# Altium project Coral_Dev_Baseboard.PrjPcb (part 4 of 5)

## Sheet 07_DEBUG.SchDoc
size A2; ApprovedBy: DNP; CheckedBy: DNP; Author: DNP; CompanyName: Google LLC; DrawnBy: DNP; Engineer: Bangfei/Michael/Leo; Organization: Google LLC; Address1: 1600 Amphitheatre Parkway; Address2: Mountain View, CA 94043; Address3: DNP; Address4: DNP; DocumentNumber: DNP; Revision: PVT; SheetNumber: 7; SheetTotal: 11; VersionControl_RevNumber: DNP; IsUserConfigurable: DNP; Time: DNP; ImagePath: DNP; Rule: DNP; ProjectName: Enterprise; Application_BuildNumber: DNP
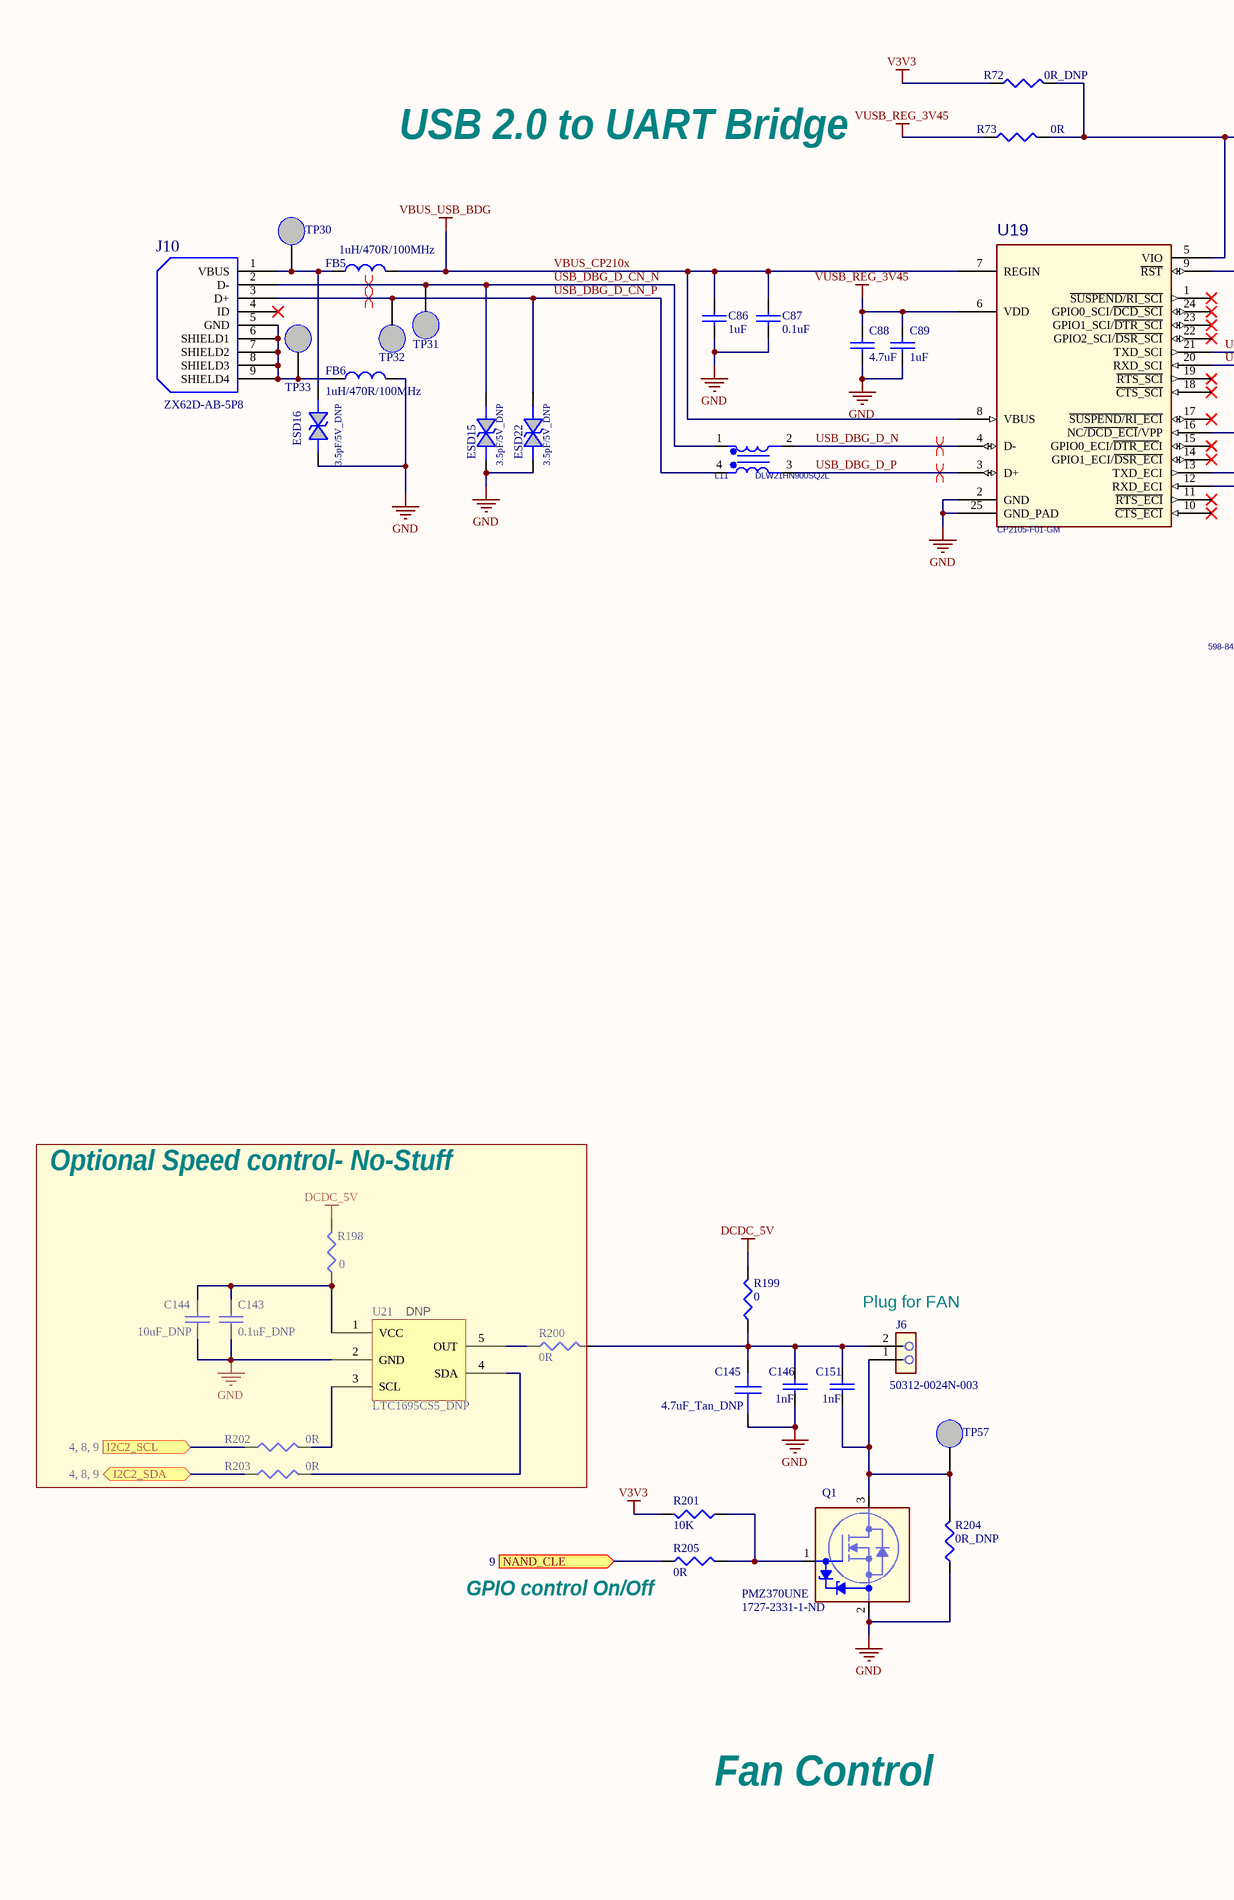
[diagram p10: 07_DEBUG.SchDoc, left]
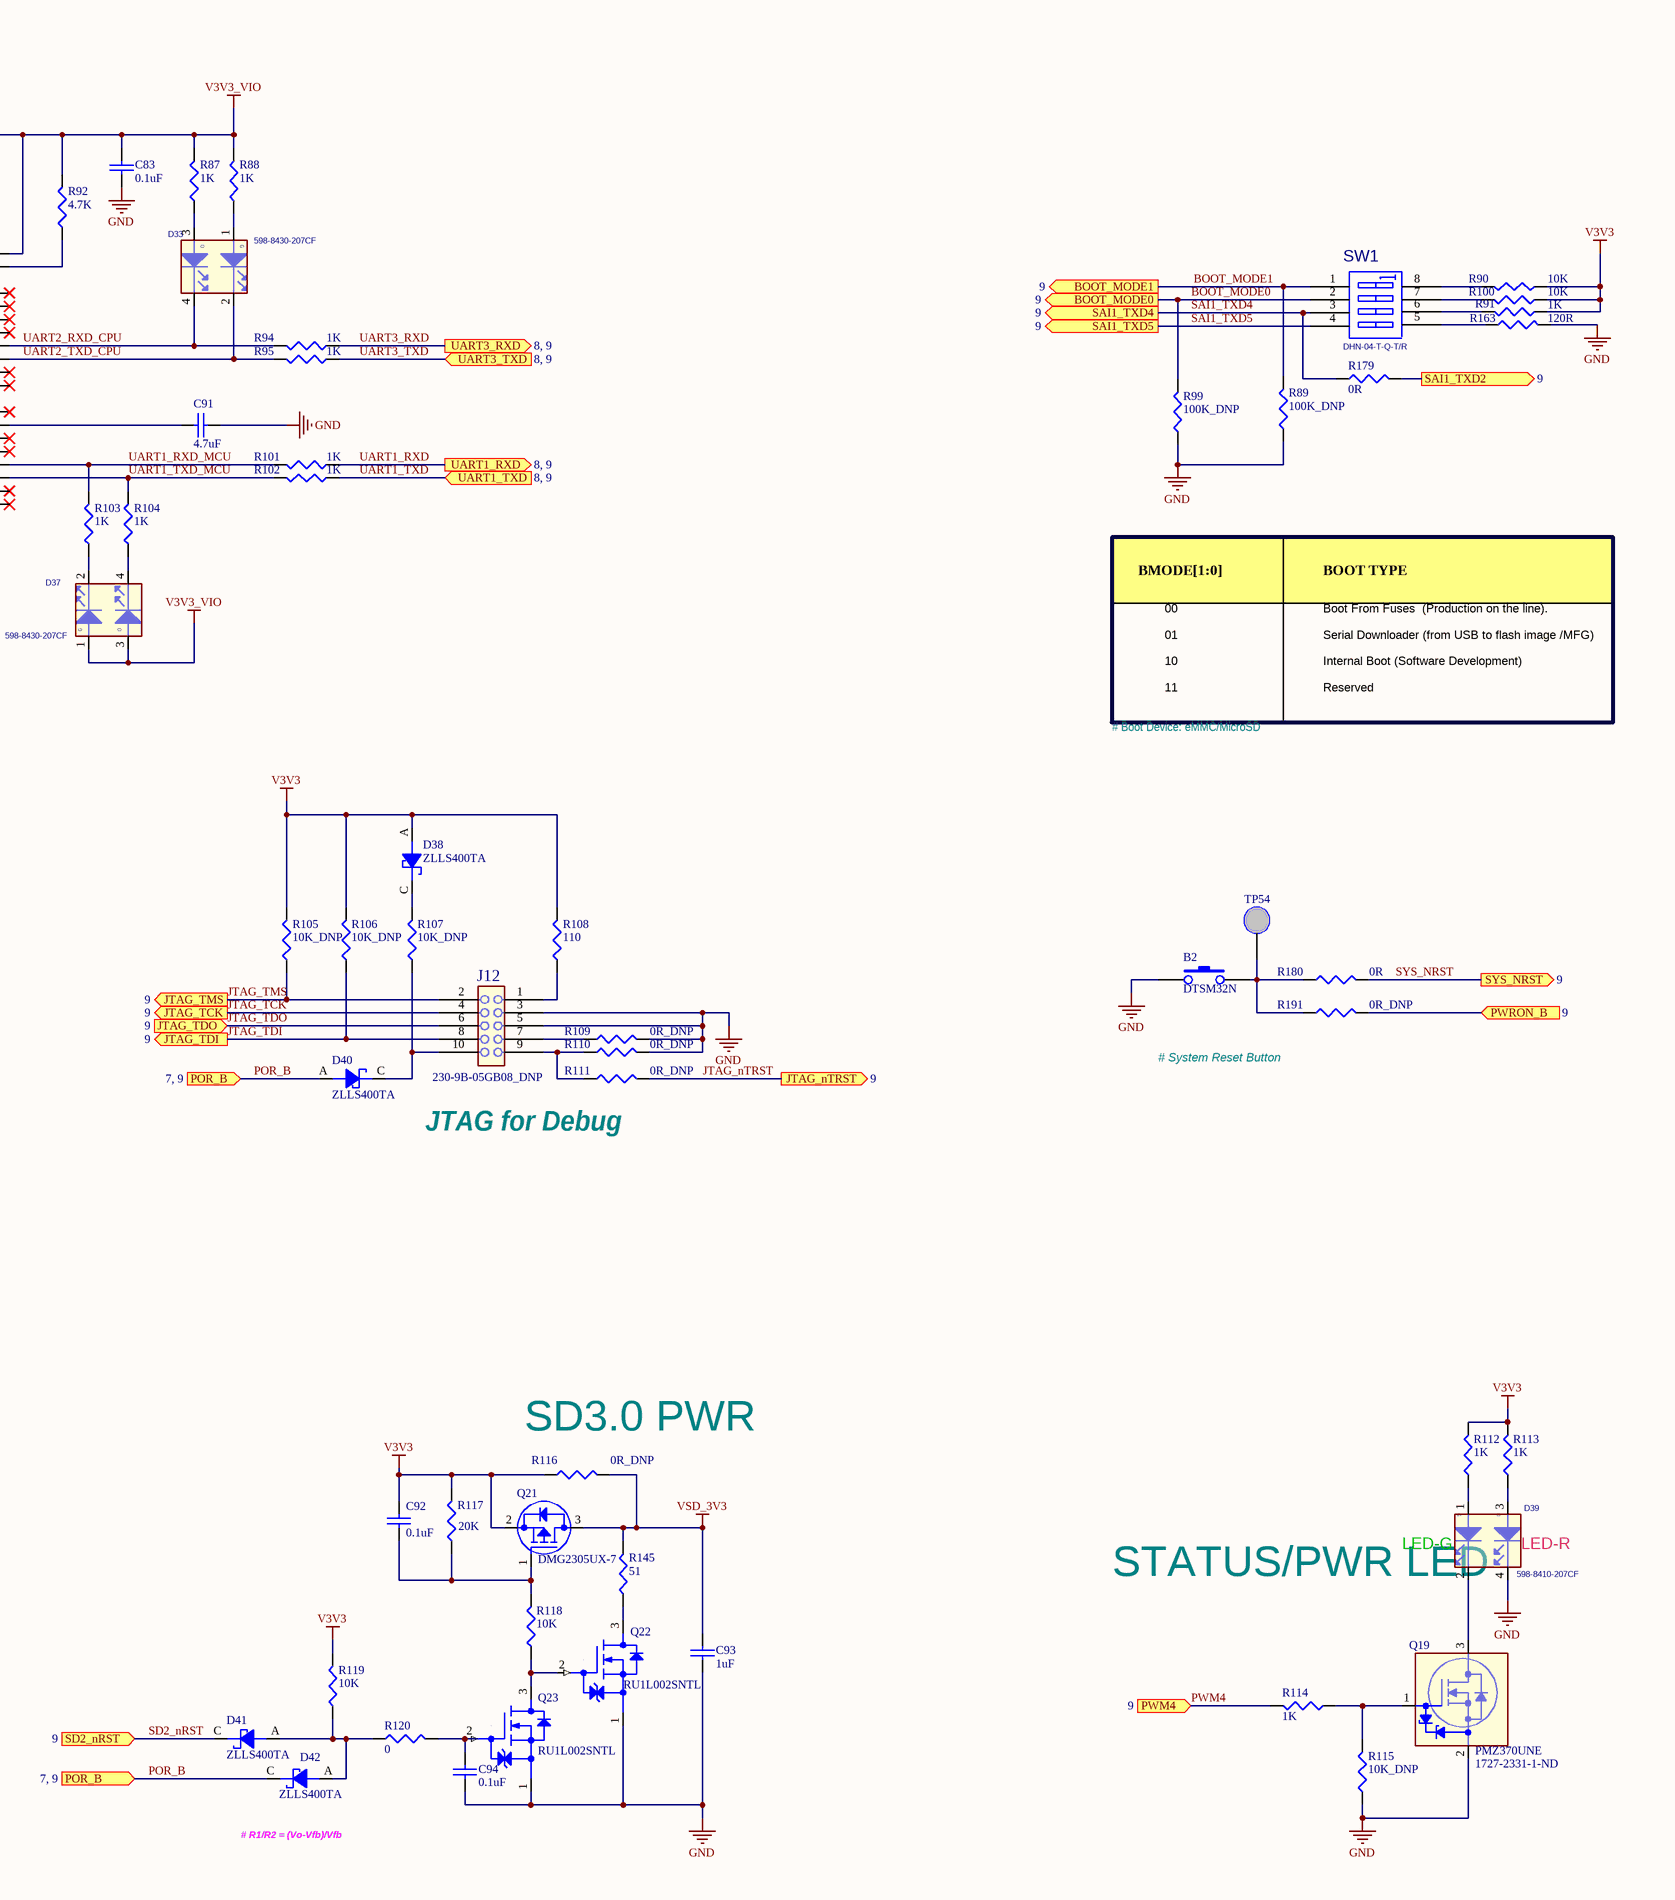
[diagram p11: 07_DEBUG.SchDoc, right]

### Parts
B2  DTSM32N  [sw2-6_0x3_5-h5_2]
C83  value 0.1uF  [0201]  (hidden comment: 0.1uF/10V)
C86  value 1uF  [0201]  (hidden comment: 1uF/6.3V)
C87  value 0.1uF  [0201]  (hidden comment: 0.1uF/10V)
C88  value 4.7uF  [0402]  (hidden comment: 4.7uF/10V)
C89  value 1uF  [0201]  (hidden comment: 1uF/6.3V)
C91  value 4.7uF  [0402]  (hidden comment: 4.7uF/10V)
C92  value 0.1uF  [0201]  (hidden comment: 0.1uF/10V)
C93  value 1uF  [0201]  (hidden comment: 1uF/6.3V)
C94  value 0.1uF  [0201]  (hidden comment: 0.1uF/10V)
C143  value 0.1uF_DNP  [0201]  (hidden comment: 0.1uF/10V)
C144  value 10uF_DNP  [0402]  (hidden comment: 10uF/10V)
C145  value 4.7uF_Tan_DNP  [1206]  (hidden comment: 47uF/25V)
C146  value 1nF  [0201]  (hidden comment: 1nF/25V)
C151  value 1nF  [0201]  (hidden comment: 1nF/25V)
D33  598-8430-207CF  [LED_0606]
D37  598-8430-207CF  [LED_0606]
D38  ZLLS400TA  [SOD323]
D39  598-8410-207CF  [LED_0606]
D40  ZLLS400TA  [SOD323]
D41  ZLLS400TA  [SOD323]
D42  ZLLS400TA  [SOD323]
ESD15  3.5pF/5V_DNP  [0201]
ESD16  3.5pF/5V_DNP  [0201]
ESD22  3.5pF/5V_DNP  [0201]
FB5  1uH/470R/100MHz  [0603]
FB6  1uH/470R/100MHz  [0603]
J6  50312-0024N-003  [SIP2-2MM-6X4_8MM-50312]
J10  ZX62D-AB-5P8  [USB5-0_65-ZX62D-AB-5P8]
J12  230-9B-05GB08_DNP  [HD2X5-1_27MM-3_35MM]
L11  DLW21HN900SQ2L  [IND4_CHOKE_0805]
Q1  PMZ370UNE  Supplier Part Number 1: 1727-2331-1-ND  [DFN10106B]
Q19  PMZ370UNE  Supplier Part Number 1: 1727-2331-1-ND  [DFN10106B]
Q21  DMG2305UX-7  [SOT-23]
Q22  RU1L002SNTL  [SOT323_3]
Q23  RU1L002SNTL  [SOT323_3]
R72  0R_DNP  [0201]
R73  0R  [0201]
R87  value 1K  [0201]  (hidden comment: 1K/1%)
R88  value 1K  [0201]  (hidden comment: 1K/1%)
R89  100K_DNP  [0201]
R90  10K  [0201]
R91  value 1K  [0201]  (hidden comment: 1K/1%)
R92  4.7K  [0201]
R94  value 1K  [0201]  (hidden comment: 1K/1%)
R95  value 1K  [0201]  (hidden comment: 1K/1%)
R99  100K_DNP  [0201]
R100  10K  [0201]
R101  value 1K  [0201]  (hidden comment: 1K/1%)
R102  value 1K  [0201]  (hidden comment: 1K/1%)
R103  value 1K  [0201]  (hidden comment: 1K/1%)
R104  value 1K  [0201]  (hidden comment: 1K/1%)
R105  10K_DNP  [0201]
R106  10K_DNP  [0201]
R107  10K_DNP  [0201]
R108  110  [0201]
R109  0R_DNP  [0201]
R110  0R_DNP  [0201]
R111  0R_DNP  [0201]
R112  value 1K  [0201]  (hidden comment: 1K/1%)
R113  value 1K  [0201]  (hidden comment: 1K/1%)
R114  value 1K  [0201]  (hidden comment: 1K/1%)
R115  10K_DNP  [0201]
R116  0R_DNP  [0402]
R117  20K  [0201]
R118  10K  [0201]
R119  10K  [0201]
R120  value 0  [0402]  (hidden comment: 0R)
R145  51  [0402]
R163  120R  [0402]
R179  0R  [0201]
R180  value 0R  [0201]  (hidden comment: 0R_DNP)
R191  0R_DNP  [0201]
R198  value 0  [0402]  (hidden comment: 0R)
R199  value 0  [0402]  (hidden comment: 0R)
R200  0R  [0402]
R201  10K  [0201]
R202  value 0R  [0201]  (hidden comment: 0)
R203  value 0R  [0201]  (hidden comment: 0)
R204  value 0R_DNP  [0402]  (hidden comment: 0R)
R205  value 0R  [0201]  (hidden comment: 0R_DNP)
SW1  DHN-04-T-Q-T/R  [SW_DIP4_SM]
TP30  TP NM  [TP_SMD_L]  (value not drawn)  (no BOM)
TP31  TP NM  [TP_SMD]  (value not drawn)  (no BOM)
TP32  TP NM  [TP_SMD]  (value not drawn)  (no BOM)
TP33  TP NM  [TP_SMD_L]  (value not drawn)  (no BOM)
TP54  TP NM  [TP_SMD_L]  (value not drawn)  (no BOM)
TP57  TP NM  [TP_SMD_L]  (value not drawn)  (no BOM)
U19  CP2105-F01-GM  [QFN24_0P5_4X4_EP]
U21  LTC1695CS5_DNP  [SOT23-S5-1695f]

### Blocks framed on the sheet
Optional Speed control- No-Stuff: C143 C144 R198 R200 R202 R203 U21

### Ports
BOOT_MODE0 (out, see 9), BOOT_MODE1 (out, see 9), I2C2_SCL (in, see 4, 8, 9), I2C2_SDA (bidir, see 4, 8, 9), JTAG_nTRST (out, see 9), JTAG_TCK (out, see 9), JTAG_TDI (out, see 9), JTAG_TDO (in, see 9), JTAG_TMS (out, see 9), NAND_CLE (in, see 9), POR_B (in, see 7, 9), PWM4 (in, see 9), PWRON_B (in, see 9), SAI1_TXD2 (out, see 9), SAI1_TXD4 (out, see 9), SAI1_TXD5 (out, see 9), SD2_nRST (in, see 9), SYS_NRST (out, see 9), UART1_RXD (out, see 8, 9), UART1_TXD (in, see 8, 9), UART3_RXD (out, see 8, 9), UART3_TXD (in, see 8, 9)

### Nets
DCDC_5V: R198.2 R199.2
GND: B2.1 C83.2 C86.2 C87.2 C88.2 C89.2 C91.2 C93.2 C94.2 C143.2 C144.2 C145.2 C146.1 D39.4(CATHODE2) ESD15.1 ESD16.1 ESD22.1 FB6.2 J12.3 J12.5 Q1.2(SOURCE) Q19.2(SOURCE) Q22.1(SOURCE) Q23.1(SOURCE) R89.1 R99.1 R109.2 R110.2 R115.1 R163.2 R204.1 U19.2(GND) U19.25(GND_PAD) U21.2(GND)
V3V3: C92.1 D38.A Q21.2(SOURCE) R72.1 R90.1 R91.1 R100.1 R105.2 R106.2 R108.2 R112.2 R113.2 R116.1 R117.2 R119.2 R201.2  [project net BB_3V3]
V3V3_VIO: C83.1 D37.1(ANODE1) D37.3(ANODE2) R72.2 R73.2 R87.2 R88.2 R92.2 U19.5(VIO)
VBUS_CP210x: C86.1 C87.1 FB5.2 U19.7(REGIN) U19.8(VBUS)  [also labelled VBUS_USB_BDG]
VSD_3V3: C93.1 Q21.3(DRAIN) R116.2 R145.2
VUSB_REG_3V45: C88.1 C89.1 R73.1 U19.6(VDD)
BOOT_MODE0: R99.2 SW1.2(A2) ; port BOOT_MODE0
BOOT_MODE1: R89.2 SW1.1(A1) ; port BOOT_MODE1
I2C2_SCL: R202.1 ; port I2C2_SCL
I2C2_SDA: R203.1 ; port I2C2_SDA
JTAG_nTRST: R111.2 ; port JTAG_nTRST
JTAG_TCK: J12.4 ; port JTAG_TCK
JTAG_TDI: J12.8 R106.1 ; port JTAG_TDI
JTAG_TDO: J12.6 ; port JTAG_TDO
JTAG_TMS: J12.2 R105.1 ; port JTAG_TMS
POR_B: D40.A D42.C ; port POR_B
PWM4: R114.2 ; port PWM4
SAI1_TXD4: R179.1 SW1.3(A3) ; port SAI1_TXD4
SAI1_TXD5: SW1.4(A4) ; port SAI1_TXD5
SD2_nRST: D41.C ; port SD2_nRST
SYS_NRST: R180.2 ; port SYS_NRST
UART1_RXD: R101.1 ; port UART1_RXD
UART1_RXD_MCU: R101.2 R103.2 U19.13(TXD_ECI)
UART1_TXD: R102.1 ; port UART1_TXD
UART1_TXD_MCU: R102.2 R104.2 U19.12(RXD_ECI)
UART2_RXD_CPU: D33.4(CATHODE2) R94.2 U19.21(TXD_SCI)
UART2_TXD_CPU: D33.2(CATHODE1) R95.2 U19.20(RXD_SCI)
UART3_RXD: R94.1 ; port UART3_RXD
UART3_TXD: R95.1 ; port UART3_TXD
USB_DBG_D_CN_N: ESD15.2 J10.2(D-) L11.1 TP31.1
USB_DBG_D_CN_P: ESD22.2 J10.3(D+) L11.4 TP32.1
USB_DBG_D_N: L11.2 U19.4(D-)
USB_DBG_D_P: L11.3 U19.3(D+)
NetB2_2: B2.2 R180.1 R191.1 TP54.1
NetC91_1: C91.1 U19.16(NC~{/DCD_ECI}/VPP)
NetC92_2: C92.2 Q21.1(GATE) R117.1 R118.2
NetC94_1: C94.1 Q23.2(GATE) R120.2
NetC143_1: C143.1 C144.1 R198.1 U21.1(VCC)
NetC145_1: C145.1 C146.2 C151.2 J6.2 R199.1 R200.2
NetC151_1: C151.1 J6.1 Q1.3(DRAIN) R204.2 TP57.1
NetD33_1: D33.1(ANODE1) R88.1
NetD33_3: D33.3(ANODE2) R87.1
NetD37_2: D37.2(CATHODE1) R103.1
NetD37_4: D37.4(CATHODE2) R104.1
NetD38_C: D38.C R107.2
NetD39_1: D39.1(ANODE1) R112.1
NetD39_2: D39.2(CATHODE1) Q19.3(DRAIN)
NetD39_3: D39.3(ANODE2) R113.1
NetD40_C: D40.C J12.10 R107.1
NetD41_A: D41.A D42.A R119.1 R120.1
NetESD16_2: ESD16.2 FB5.1 J10.1(VBUS) TP30.1
NetFB6_1: FB6.1 J10.5(GND) J10.6(SHIELD1) J10.7(SHIELD2) J10.8(SHIELD3) J10.9(SHIELD4) TP33.1
NetJ12_1: J12.1 R108.1
NetJ12_7: J12.7 R109.1
NetJ12_9: J12.9 R110.1 R111.1
NetJ1310_10: R205.1 ; port NAND_CLE
NetJ1312_30: R179.2 ; port SAI1_TXD2
NetJ1312_86: R191.2 ; port PWRON_B
NetQ1_1: Q1.1(GATE) R201.1 R205.2
NetQ19_1: Q19.1(GATE) R114.1 R115.2
NetQ22_2: Q22.2(GATE) Q23.3(DRAIN) R118.1
NetQ22_3: Q22.3(DRAIN) R145.1
NetR90_2: R90.2 SW1.8(B1)
NetR91_2: R91.2 SW1.6(B3)
NetR92_1: R92.1 U19.9(~{RST})
NetR100_2: R100.2 SW1.7(B2)
NetR163_1: R163.1 SW1.5(B4)
NetR200_1: R200.1 U21.5(OUT)
NetR202_2: R202.2 U21.3(SCL)
NetR203_2: R203.2 U21.4(SDA)

Not connected (* = marked no-connect by the designer): J10 4(ID)*; U19 1(~{SUSPEND/RI_SCI})* 10(~{CTS_ECI})* 11(~{RTS_ECI})* 14(GPIO1_ECI/~{DSR_ECI})* 15(GPIO0_ECI/~{DTR_EC}I)* 17(~{SUSPEND/RI_ECI})* 18(~{CTS_SCI})* 19(~{RTS_SCI})* 22(GPIO2_SCI/~{DSR_SCI})* 23(GPIO1_SCI/~{DTR_SCI})* 24(GPIO0_SCI/~{DCD_SCI})*

### Layout directives
differential pair: USB_DBG_D_CN_N, USB_DBG_D_CN_P, USB_DBG_D_N, USB_DBG_D_P

### Notes on the sheet
- USB 2.0 to UART Bridge
- BMODE[1:0]
- 00
- 01
- BOOT TYPE
- Boot From Fuses  (Production on the line).
- Serial Downloader (from USB to flash image /MFG)
- 10
- 11
- Internal Boot (Software Development)
- Reserved
- # Boot Device: eMMC/MicroSD
- # System Reset Button
- (near R111) JTAG for Debug
- (near U21) DNP
- (near J6) Plug for FAN
- (near R116) SD3.0 PWR
- (near D39) LED-G
- (near D39) LED-R
- (near R205) GPIO control On/Off
- STATUS/PWR LED
- Fan Control
- # R1/R2 = (Vo-Vfb)/Vfb
- Project:
- Engineer:
- Date:
- File:
- Revision:
- Sheet
- of
- (in symbol LED4_DUAL_OG) O; G

### Library data of the parts
B2 = SW-PB: Tact Switch; MPN: DTSM-32N-Q-TR; QCI MPN: DTSM-32N-Q-T/R; Function Code: DBG; QPN: DHP00032N02; QPN Description: SWITCH TACT SMD DTSM-61N-S-Q-T/R; Supplier Part Number 1: 679-2307-2-ND; Supplier 1: Digi-Key; Value: DTSM32N; QCI Supplier: DIP
C83 C87 C92 C94 = CAP_0201_0.1uF: CAP CER 0.1UF 10V 10% X5R 0201; MPN: C0603X5R1A104K030BC; QCI MPN: GRM033R61A104K; QPN: CH4102K9E00; QPN Description: CAP CHIP 0.1U 10V(+-10%,X5R,0201); Function Code: DBG; Supplier 1: Digi-Key; Supplier Part Number 1: 445-7318-1-ND; QCI Supplier: MUR
C86 C89 C93 = CAP_0201_1.0uF: CAP CER 1UF 6.3V 20% X5R 0201; MPN: C0603X5R0J105M030BC; QCI MPN: GRM033R60J105M; QPN: CH5101M9E02; QPN Description: CAP CHIP 1UF 6.3V(+-20%,X5R,0201); Function Code: DBG; Supplier 1: Digi-Key; Supplier Part Number 1: 445-8008-1-ND; QCI Supplier: MUR
C88 C91 = CAP_0402_4.7uF: CAP CER 4.7UF 10V 20% X5R 0402; MPN: C1005X5R1A475M050BC; QCI MPN: GRM155R61A475M; QPN: CH5472M9B01; QPN Description: CAP CHIP 4.7U 10V(+-20%,X5R,0402); Function Code: DBG; Supplier 1: Digi-Key; Supplier Part Number 1: 445-8023-1-ND; QCI Supplier: MUR
C143 = CAP_0201_0.1uF: as C5 on sheet 05_AUDIO; Supplier 1: Digi-Key; Supplier Part Number 1: 445-7318-1-ND; QCI Supplier: MUR
C144 = CAP_0402_10uF: as C141 on sheet 05_AUDIO; Supplier 1: Digi-Key; Supplier Part Number 1: 1276-1450-1-ND; QCI Supplier: MUR
C145 = CAP_1206_47uF_25V: CAP CER 47UF 25V 20% 1206; MPN: C3216JB1E476M160AC; Function Code: USB; Supplier 1: Digi-Key; Supplier Part Number 1: 445-11717-1-ND
C146 C151 = CAP_0201_1.0nF: as C20 on sheet 05_AUDIO; Supplier 1: Digi-Key; Supplier Part Number 1: 490-3184-2-ND; QCI Supplier: MUR
D33 D37 = LED4_DUAL_OG: LED BI-COLOR ORANGE/GRN 20MA SMD 0606; Function Code: DBG; QPN: BEAG0003ZA0; QPN Description: LED SMD 4P O/G(598-8430-207CF); Supplier 1: Mouser; Supplier Part Number 1: 645-598-8430-207F; MPN: 598-8430-207CF; QCI MPN: 598-8430-207CF; QCI Supplier: DLH
D38 D40-D42 = DIODE_SCHTKY: DIODE SCHOTTKY 40V 520MA SOD323; Function Code: DBG; QPN: BCS400TA000; QPN Description: DIODE SCHOTTKY ZLLS400TA(20V,1A); Supplier 1: Digi-Key; Supplier Part Number 1: ZLLS400TACT-ND; QCI Supplier: DDS; MPN: ZLLS400TA; QCI MPN: ZLLS400TA
D39 = LED4_DUAL_OG: LED BI-COLOR ORANGE/GRN 20MA SMD 0606; MPN: 598-8430-207CF; Function Code: DBG; QPN: BEAG0003ZA0; QPN Description: LED SMD 4P O/G(598-8430-207CF); Supplier 1: Mouser; Supplier Part Number 1: 645-598-8430-207F; QCI MPN: 598-8430-207CF; QCI Supplier: DLH
ESD15 ESD16 ESD22 = DIODE BI-DIR TRIG: DIODE TVS 15kV 10V 50A 8pF SMT RoHS; MPN: DESD5V0V1BCSP-7; QPN: BC5V0V1BZ02; QPN Description: DIODE ESD SMD DESD5V0V1BCSP-7 6V,DSN0603; Function Code: DBG; DNP: V; QCI MPN: DESD5V0V1BCSP-7; QCI Supplier: DDS
FB5 FB6 = INDUCTOR_BLM18PG471SN1: FERRITE CHIP 470 OHM 1.0A 0603; QCI MPN: BLM18PG471SN1D; QPN: CX8PG471000; QPN Description: EMI FILTER BLM18PG471SN1D(470,1000MA); Function Code: DBG; Supplier 1: Digi-Key; Supplier Part Number 1: 490-5223-1-ND; Value: 1uH/470R/100MHz; QCI Supplier: MUR; MPN: BLM18PG471SN1
J6 = HEADER 1X2: CONN DIP HEADER 2P 1R MS(P2.0,H6.2); Function Code: DCD; QPN: DFHD02MS182; MPN: 50312-0024N-003; QCI MPN: 50312-0024N-003; QCI Supplier: ACS; QPN Description: CONN DIP HEADER 2P 1R MS(P2.0,H6.2)
J10 = USB_AB: Micro USB AB Connector, Standard SMT + DIP; QPN: DFHS05FR095; QPN Description: CONN DIP MICRO USB 5P 1R FR(P0.65,H2.95); Function Code: DBG; Supplier 1: Digi-Key; Supplier Part Number 1: H11494CT-ND; Value: ZX62D-AB-5P8; QCI Supplier: HRS; MPN: ZX62D-AB-5P8; QCI MPN: ZX62D-AB-5P8
J12 = HEADER 2x5: 2x5 pin header, 1.27mm pitch, THM; DNP: V; Function Code: DBG; MPN: 230-9B-05GB08; Supplier 1: Digi-Key; Supplier Part Number 1: 609-3712-ND; Value: 230-9B-05GB08_DNP; QCI Supplier: Pinrex
L11 = IND_CMC_DLW21: IND CHK 90 OHM@100MHZ 330MA 25% 0805; QPN: CX1HN900000; QPN Description: EMI FILTER DLW21HN900SQ2L(90,330MA); Function Code: DBG; Supplier 1: Digi-Key; Supplier Part Number 1: 490-1064-1-ND; MPN: DLW21HN900SQ2L; QCI MPN: DLW21HN900SQ2L; QCI Supplier: MUR
Q1 = NMOS_NX3008NBK: N-Channel 30V 590mA, SMT DFN1006B-3; MPN: PMZB550UNEYL; Function Code: USB; QPN: BAM03700000; QPN Description: TRANS MOSFET PMZ370UNE (30V,0.9 A,0.36W); Supplier 1: Digi-Key; QCI MPN: PMZ370UNE; QCI Supplier: NXP
Q19 = NMOS_NX3008NBK: N-Channel 30V 590mA, SMT DFN1006B-3; MPN: PMZB550UNEYL; Function Code: DBG; QPN: BAM03700000; QPN Description: TRANS MOSFET PMZ370UNE (30V,0.9 A,0.36W); Supplier 1: Digi-Key; QCI MPN: PMZ370UNE; QCI Supplier: NXP
Q21 = MOSFET_P: P-Channel 20V 4.2A (Ta) 1.4W (Ta) Surface Mount SOT-23; Function Code: DBG; QPN: BAM23050008; QPN Description: TRANS MOS DMG2305UX-7(20V,4.2A,1.4W); Supplier 1: Digi-Key; Supplier Part Number 1: DMG2305UX-13DITR-ND; MPN: DMG2305UX-7; QCI MPN: DMG2305UX-7; QCI Supplier: DDS
Q22 Q23 = 2SK3018: N-Channel 30V 100mA (Ta) 200mW (Ta) Surface Mount SOT-323; QPN: BAM1L000000; QPN Description: TRANS MOS RU1L002SN(60V,0.25A,0.2W)SC-85; Function Code: DBG; MPN: SOT323_3; QCI MPN: RU1L002SN; QCI Supplier: ROH
R72 R109-R111 R180 R191 R202 R203 = R_0201_0: RES SMD 0.0OHM JUMPER 1/20W 0201; MPN: ERJ-1GN0R00C; QCI MPN: RC0201JR-130RL; DNP: V; QPN: CS00001JE18; QPN Description: RES CHIP 0(1/20W,+-5%,0201); Function Code: DBG; Supplier 1: Digi-Key; Supplier Part Number 1: P15979CT-ND; QCI Supplier: YGO
  R72 R109-R111 R191: VALUE: 0R_DNP
R73 = R_0201_0: RES SMD 0.0OHM JUMPER 1/20W 0201; MPN: ERJ-1GN0R00C; QCI MPN: RC0201JR-130RL; QPN: CS00001JE18; QPN Description: RES CHIP 0(1/20W,+-5%,0201); Function Code: DBG; Supplier 1: Digi-Key; Supplier Part Number 1: P15979CT-ND; VALUE: 0R; QCI Supplier: YGO
R87 R88 R94 R95 R101-R104 R112-R114 = R_0201_1K: RES SMD 1K OHM 1% 1/20W 0201; MPN: ERJ-1GEF1001C; QCI MPN: RC0201FR-131KL; QPN: CS21001FE04; QPN Description: RES CHIP 1K 1/20W +-1%(0201); Function Code: DBG; Supplier 1: Digi-Key; Supplier Part Number 1: P1.00KABCT-ND; QCI Supplier: YGO
R89 R99 = R_0201_100K: RES SMD 100K OHM JUMPER 1/20W  0201; MPN: ERJ-1GEF1003C; QCI MPN: RC0201FR-07100KL; DNP: V; QPN: TS41001FE04; QPN Description: RES CHIP 100K 1/20W +-1%(0201)EMS-SEL; Function Code: DBG; Supplier 1: Digi-Key; VALUE: 100K_DNP; Supplier Part Number 1: P100KABCT-ND; QCI Supplier: YGO
R90 R100 R118 R119 = R_0201_10K: RES SMD 10K OHM JUMPER 1/20W  0201; MPN: ERJ-1GEF103C; QCI MPN: RC0201JR-1310KL; QPN: CS31001JE16; QPN Description: RES CHIP 10K 1/20W +-5%(0201); Function Code: DBG; Supplier 1: Digi-Key; VALUE: 10K; Supplier Part Number 1: P10.0KABCT-ND; QCI Supplier: YGO
R91 = R_0201_1K: RES SMD 1K OHM 1% 1/20W 0201; MPN: ERJ-1GEF1001C; QCI MPN: RC0201FR-131KL; QPN: CS21001FE04; QPN Description: RES CHIP 1K 1/20W +-1%(0201); Function Code: USB; Supplier 1: Digi-Key; Supplier Part Number 1: P1.00KABCT-ND; QCI Supplier: YGO
R92 = R_0201_4.7K: RES SMD 4.7K OHM 1% 1/20W 0201; MPN: ERJ-1GEF4701C; QCI MPN: RC0201FR-134K7L; QPN: CS24701FE00; QPN Description: RES CHIP 4.7K 1/20W +-1%(0201; Function Code: DBG; Supplier 1: Digi-Key; Supplier Part Number 1: P4.70KABCT-ND; VALUE: 4.7K; QCI Supplier: YGO
R105-R107 R115 = R_0201_10K: RES SMD 10K OHM JUMPER 1/20W  0201; MPN: ERJ-1GEF103C; QCI MPN: RC0201JR-1310KL; DNP: V; QPN: CS31001JE16; QPN Description: RES CHIP 10K 1/20W +-5%(0201); Function Code: DBG; Supplier 1: Digi-Key; VALUE: 10K_DNP; Supplier Part Number 1: P10.0KABCT-ND; QCI Supplier: YGO
R108 = R_0201_110: RES SMD 110 OHM 1% 1/20W 0201; MPN: ERJ-1GEF1100C; QCI MPN: RC0201FR-07110RL; QPN: CS11101FE00; QPN Description: RES CHIP 110 1/20W +-1% (0201); Function Code: DBG; Supplier 1: Digi-Key; Supplier Part Number 1: P110ABCT-ND; VALUE: 110; QCI Supplier: YGO
R116 = R_0402_0: RES SMD 0.0 OHM JUMPER 1/10W  0402; MPN: ERJ-2GE0R00X; QCI MPN: RC0402FR-070RL; DNP: V; QPN: CS00002FB00; QPN Description: RES CHIP 0 1/16W +-1%(0402); Function Code: DBG; Supplier 1: Digi-Key; Supplier Part Number 1: P0.0JCT-ND; VALUE: 0R_DNP; QCI Supplier: YGO
R117 = R_0201_20K: RES SMD 20K OHM 1% 1/20W 0201; MPN: ERJ-1GEF2002C; QCI MPN: RC0201FR-0720KL; QPN: CS32001FE00; QPN Description: RES CHIP 20K 1/20W +-1%(0201); Function Code: DBG; Supplier 1: Digi-Key; Supplier Part Number 1: P20.0KABCT-ND; VALUE: 20K; QCI Supplier: YGO
R120 R198-R200 = R_0402_0: as R174 on sheet 05_AUDIO; Supplier 1: Digi-Key; Supplier Part Number 1: P0.0JCT-ND; QCI Supplier: YGO
  R200: VALUE: 0R
R145 = R_0402_51: RES SMD 51 OHM 1% 1/10W 0402; MPN: ERJ-2RKF51R0X; QCI MPN: RC0402FR-0751RL; QPN: CS05102FB09; QPN Description: RES CHIP 51 1/16W +-1% (0402); Function Code: DBG; Supplier 1: Digi-Key; Supplier Part Number 1: P51.0LCT-ND; VALUE: 51; QCI Supplier: YGO
R163 = R_0402_120: RES SMD 120 OHM 1% 1/10W 0402; MPN: RC0402FR-07120R; QPN: CS11202FB03; QPN Description: RES CHIP 120 1/16W +-1%(0402); Function Code: DBG; Supplier 1: Digi-Key; Supplier Part Number 1: P120LTR-ND; VALUE: 120R; QCI Supplier: YGO; QCI MPN: RC0402FR-07120R
R179 = R_0805_0: as R24 on sheet 05_AUDIO; Supplier 1: Digi-Key; Supplier Part Number 1: P15979CT-ND; Value: 0R; QCI Supplier: YGO
R201 = R_0201_10K: RES SMD 10K OHM JUMPER 1/20W  0201; MPN: ERJ-1GEF103C; QCI MPN: RC0201JR-1310KL; QPN: CS31001JE16; QPN Description: RES CHIP 10K 1/20W +-5%(0201); Function Code: USB; Supplier 1: Digi-Key; VALUE: 10K; Supplier Part Number 1: P10.0KABCT-ND; QCI Supplier: YGO
R204 = R_0402_0: RES SMD 0.0 OHM JUMPER 1/10W  0402; MPN: ERJ-2GE0R00X; QCI MPN: RC0402FR-070RL; QPN: CS00002FB00; QPN Description: RES CHIP 0 1/16W +-1%(0402); Function Code: USB; Supplier 1: Digi-Key; Supplier Part Number 1: P0.0JCT-ND; QCI Supplier: YGO
R205 = R_0201_0: RES SMD 0.0OHM JUMPER 1/20W 0201; MPN: ERJ-1GN0R00C; QCI MPN: RC0201JR-130RL; DNP: V; QPN: CS00001JE18; QPN Description: RES CHIP 0(1/20W,+-5%,0201); Function Code: USB; Supplier 1: Digi-Key; Supplier Part Number 1: P15979CT-ND; QCI Supplier: YGO
SW1 = SW_DIP-4: SW 4P SPST DIP 25MA 24V SMT; Function Code: DBG; QPN: DHDDHN04T00; QPN Description: SWITCH DIP(DHN-04-T-Q-T/R); MPN: DHN-04-T-Q-T/R; QCI MPN: DHN-04-T-Q-T/R; QCI Supplier: DIP
TP30 TP33 TP54 TP57 = TP_L: TEST POINT (Large)
TP31 TP32 = TP: TEST POIN
U19 = CP2105_QFN24P: IC XCVR USB TO DUAL-UART 3.0-3.6V QFN24; QPN: AL002105001; QPN Description: IC CTRL(24P)CP2105-F01-GM(QFN); Function Code: DBG; Supplier 1: Digi-Key; Supplier Part Number 1: CP2105-F01-GMRCT-ND; MPN: CP2105-F01-GM; QCI MPN: CP2105-F01-GM; QCI Supplier: SLI
U21 = LTC1695: LTC1695CS5

## Sheet 08_EXP_CN.SchDoc
size A2; ApprovedBy: DNP; CheckedBy: DNP; Author: DNP; CompanyName: Google LLC; DrawnBy: DNP; Engineer: Bangfei/Michael/Leo; Organization: Google LLC; Address1: 1600 Amphitheatre Parkway; Address2: Mountain View, CA 94043; Address3: DNP; Address4: DNP; DocumentNumber: DNP; Revision: PVT; SheetNumber: 8; SheetTotal: 11; VersionControl_RevNumber: DNP; IsUserConfigurable: DNP; Time: DNP; ImagePath: DNP; Rule: DNP; ProjectName: Enterprise; Application_BuildNumber: DNP
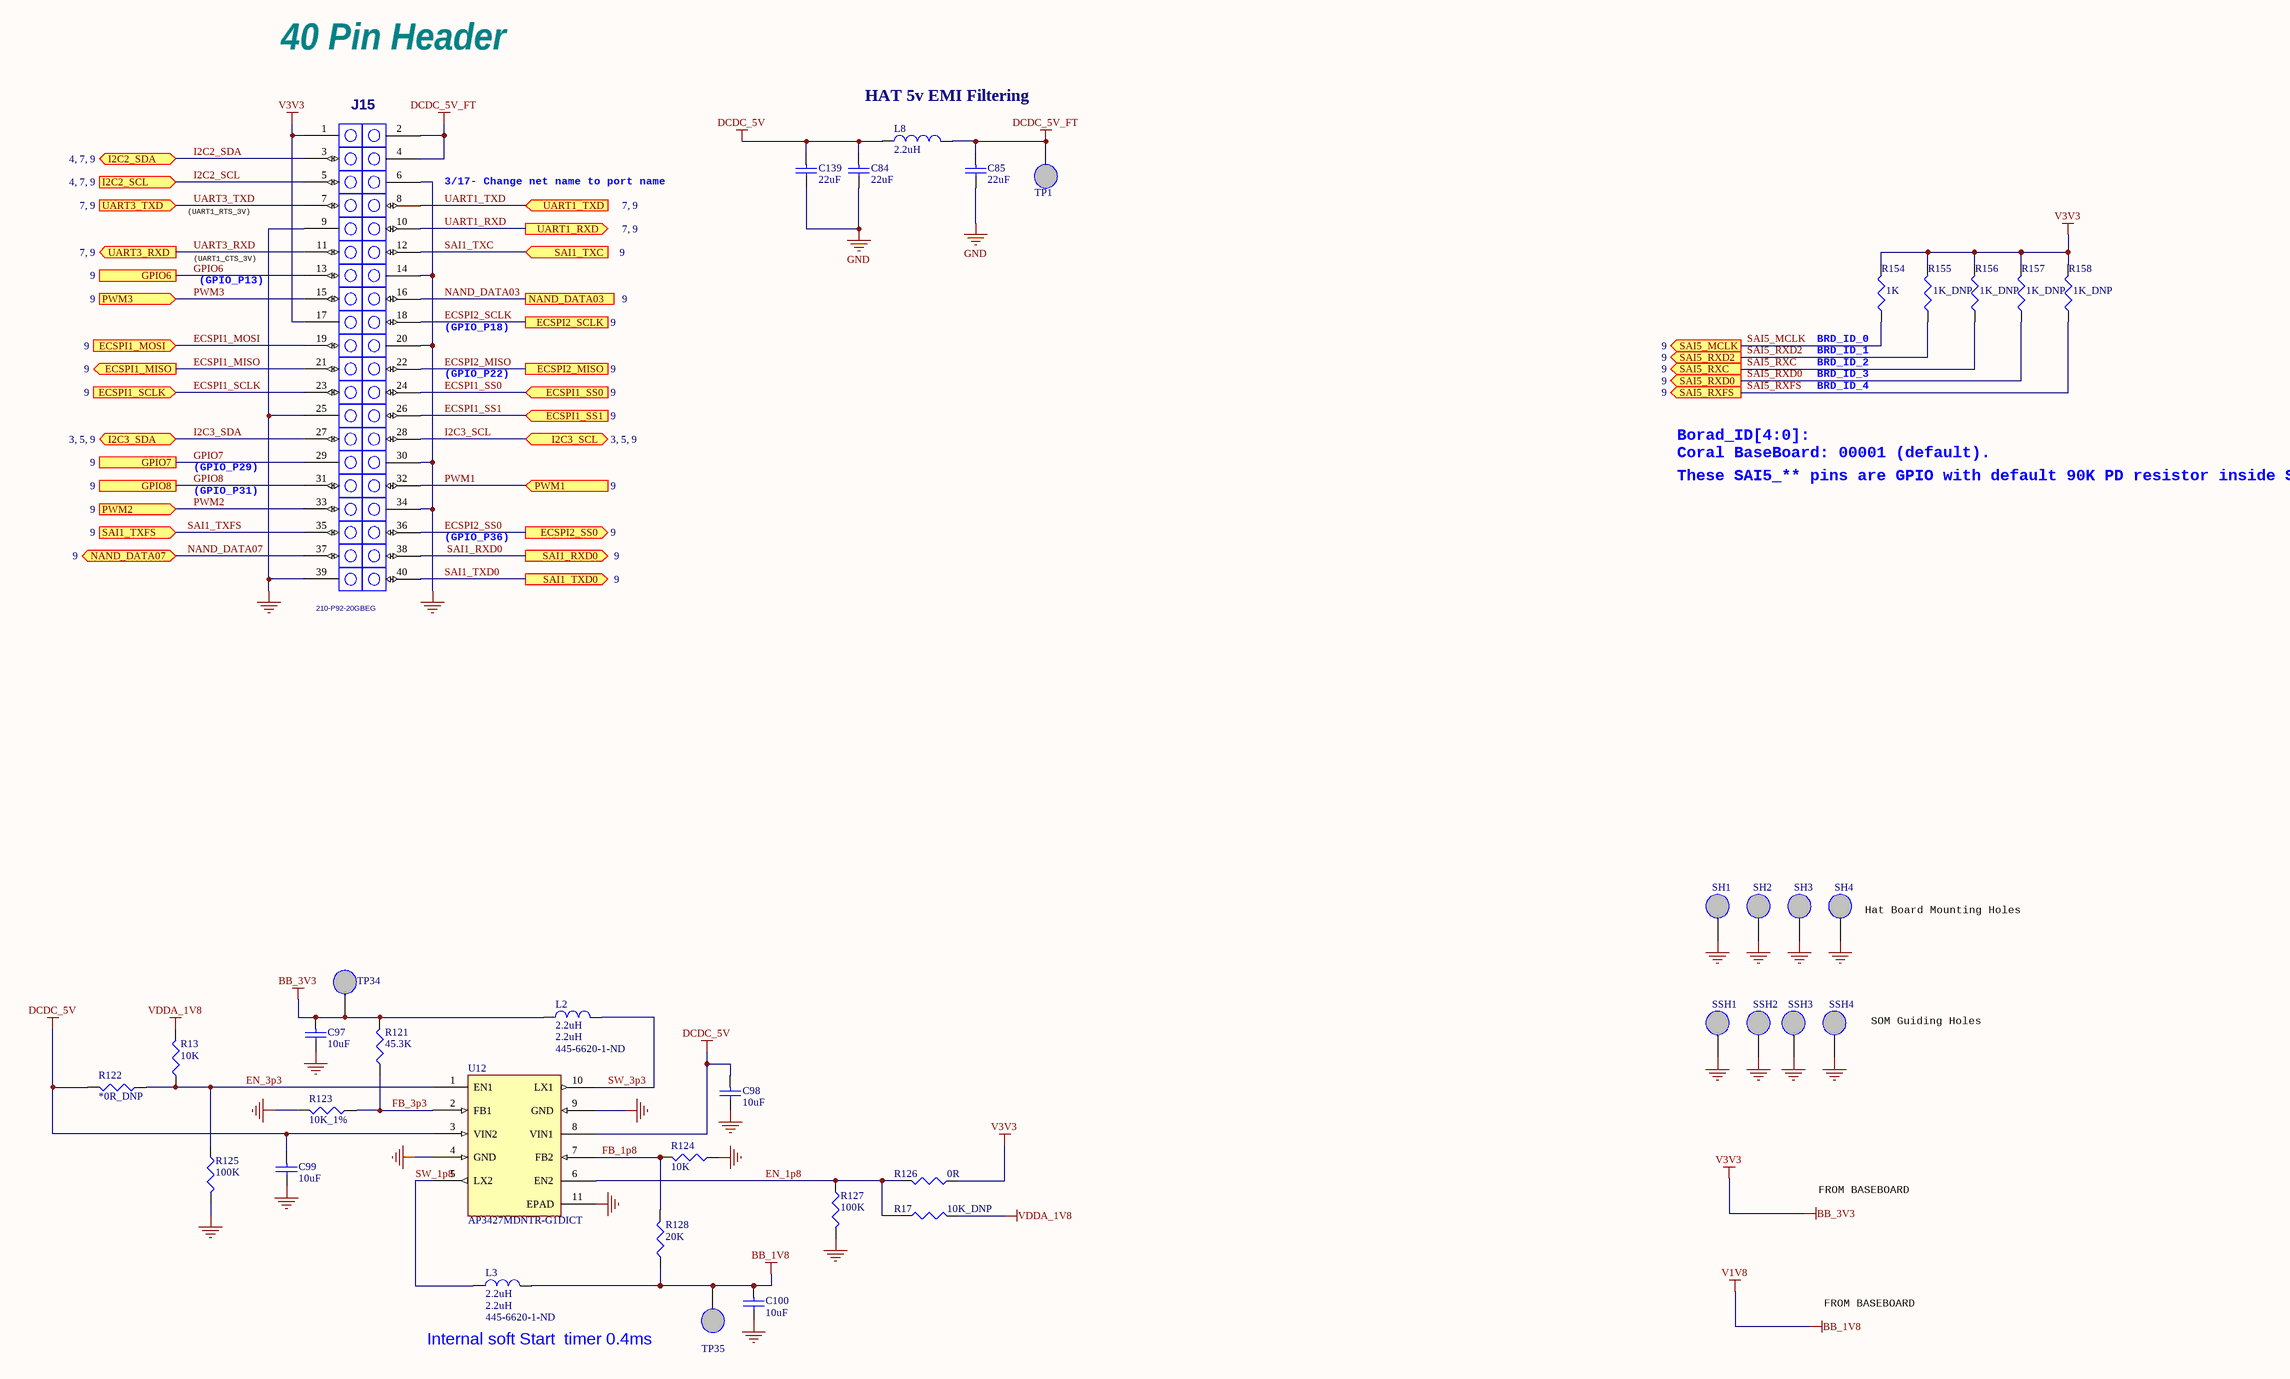
[diagram p12: 08_EXP_CN.SchDoc]

### Parts
C84  value 22uF  [0603]  (hidden comment: 22uF/10V)
C85  value 22uF  [0603]  (hidden comment: 22uF/10V)
C97  value 10uF  [0402]  (hidden comment: 10uF/10V)
C98  value 10uF  [0402]  (hidden comment: 10uF/10V)
C99  value 10uF  [0402]  (hidden comment: 10uF/10V)
C100  value 10uF  [0402]  (hidden comment: 10uF/10V)
C139  value 22uF  [0603]  (hidden comment: 22uF/10V)
J15  210-P92-20GBEG  [HTSW-120-41-G-D]
L2  2.2uH  Supplier Part Number 1: 445-6620-1-ND  [INDC2016X12L]
L3  2.2uH  Supplier Part Number 1: 445-6620-1-ND  [INDC2016X12L]
L8  2.2uH  [0805_PADS]
R13  value 10K  [0201]  (hidden comment: 10K_DNP)
R17  10K_DNP  [0201]
R121  45.3K  [0201]
R122  value *0R_DNP  [0201]  (hidden comment: 0R)
R123  value 10K_1%  [0201]  (hidden comment: 10K)
R124  10K  [0201]
R125  100K  [0201]
R126  0R  [0201]
R127  100K  [0201]
R128  20K  [0201]
R154  value 1K  [0201]  (hidden comment: 1K/1%)
R155  1K_DNP  [0201]
R156  1K_DNP  [0201]
R157  1K_DNP  [0201]
R158  1K_DNP  [0201]
SH1  TP NM  [hole236-110]  (value not drawn)  (no BOM)
SH2  TP NM  [hole236-110]  (value not drawn)  (no BOM)
SH3  TP NM  [hole236-110]  (value not drawn)  (no BOM)
SH4  TP NM  [hole236-110]  (value not drawn)  (no BOM)
SSH1  stand-off  [hole120-80]  (value not drawn)  (no BOM)
SSH2  stand-off  [hole120-80]  (value not drawn)  (no BOM)
SSH3  stand-off  [hole120-80]  (value not drawn)  (no BOM)
SSH4  stand-off  [hole120-80]  (value not drawn)  (no BOM)
TP1  TP NM  [TP_SMD]  (value not drawn)  (no BOM)
TP34  TP NM  [TP_SMD_L]  (value not drawn)  (no BOM)
TP35  TP NM  [TP_SMD_L]  (value not drawn)  (no BOM)
U12  AP3427MDNTR-G1DICT  [DFN_10_3X3]

### Ports
ECSPI1_MISO (out, see 9), ECSPI1_MOSI (in, see 9), ECSPI1_SCLK (in, see 9), ECSPI1_SS0 (in, see 9), ECSPI1_SS1 (in, see 9), ECSPI2_MISO (see 9), ECSPI2_SCLK (see 9), ECSPI2_SS0 (out, see 9), GPIO6 (see 9), GPIO7 (see 9), GPIO8 (see 9), I2C2_SCL (in, see 4, 7, 9), I2C2_SDA (bidir, see 4, 7, 9), I2C3_SCL (bidir, see 3, 5, 9), I2C3_SDA (bidir, see 3, 5, 9), NAND_DATA03 (see 9), NAND_DATA07 (bidir, see 9), PWM1 (in, see 9), PWM2 (in, see 9), PWM3 (in, see 9), SAI1_RXD0 (out, see 9), SAI1_TXC (in, see 9), SAI1_TXD0 (out, see 9), SAI1_TXFS (in, see 9), SAI5_MCLK (out, see 9), SAI5_RXC (out, see 9), SAI5_RXD0 (out, see 9), SAI5_RXD2 (out, see 9), SAI5_RXFS (out, see 9), UART1_RXD (out, see 7, 9), UART1_TXD (in, see 7, 9), UART3_RXD (out, see 7, 9), UART3_TXD (in, see 7, 9)

### Nets
BB_1V8: C100.1 L3.2 R128.1 TP35.1  [also labelled V1V8]
BB_3V3: C97.1 J15.1 J15.17 L2.1 R121.2 R126.1 R154.2 R155.2 R156.2 R157.2 R158.2 TP34.1  [also labelled V3V3]
DCDC_5V: C84.1 C98.1 C99.1 C139.1 L8.1 R122.2 U12.3(VIN2) U12.8(VIN1)
DCDC_5V_FT: C85.1 J15.2 J15.4 L8.2 TP1.1
GND: C84.2 C85.2 C97.2 C98.2 C99.2 C100.2 C139.2 J15.6 J15.9 J15.14 J15.20 J15.25 J15.30 J15.34 J15.39 R123.2 R124.1 R125.2 R127.2 SH1.1 SH2.1 SH3.1 SH4.1 SSH1.1 SSH2.1 SSH3.1 SSH4.1 U12.4(GND) U12.9(GND) U12.11(EPAD)
VDDA_1V8: R13.2 R17.2
ECSPI1_MISO: J15.21 ; port ECSPI1_MISO
ECSPI1_MOSI: J15.19 ; port ECSPI1_MOSI
ECSPI1_SCLK: J15.23 ; port ECSPI1_SCLK
ECSPI1_SS0: J15.24 ; port ECSPI1_SS0
ECSPI1_SS1: J15.26 ; port ECSPI1_SS1
ECSPI2_MISO: J15.22 ; port ECSPI2_MISO
ECSPI2_SCLK: J15.18 ; port ECSPI2_SCLK
ECSPI2_SS0: J15.36 ; port ECSPI2_SS0
EN_1p8: R17.1 R126.2 R127.1 U12.6(EN2)
EN_3p3: R13.1 R122.1 R125.1 U12.1(EN1)
FB_1p8: R124.2 R128.2 U12.7(FB2)
FB_3p3: R121.1 R123.1 U12.2(FB1)
GPIO6: J15.13 ; port GPIO6
GPIO7: J15.29 ; port GPIO7
GPIO8: J15.31 ; port GPIO8
I2C2_SCL: J15.5 ; port I2C2_SCL
I2C2_SDA: J15.3 ; port I2C2_SDA
I2C3_SCL: J15.28 ; port I2C3_SCL
I2C3_SDA: J15.27 ; port I2C3_SDA
NAND_DATA03: J15.16 ; port NAND_DATA03
NAND_DATA07: J15.37 ; port NAND_DATA07
PWM1: J15.32 ; port PWM1
PWM2: J15.33 ; port PWM2
PWM3: J15.15 ; port PWM3
SAI1_RXD0: J15.38 ; port SAI1_RXD0
SAI1_TXC: J15.12 ; port SAI1_TXC
SAI1_TXD0: J15.40 ; port SAI1_TXD0
SAI1_TXFS: J15.35 ; port SAI1_TXFS
SAI5_MCLK: R154.1 ; port SAI5_MCLK
SAI5_RXC: R156.1 ; port SAI5_RXC
SAI5_RXD0: R157.1 ; port SAI5_RXD0
SAI5_RXD2: R155.1 ; port SAI5_RXD2
SAI5_RXFS: R158.1 ; port SAI5_RXFS
SW_1p8: L3.1 U12.5(LX2)
SW_3p3: L2.2 U12.10(LX1)
UART1_RXD: J15.10 ; port UART1_RXD
UART1_TXD: J15.8 ; port UART1_TXD
UART3_RXD: J15.11 ; port UART3_RXD
UART3_TXD: J15.7 ; port UART3_TXD

### Notes on the sheet
- 40 Pin Header
- (near L8) HAT 5v EMI Filtering
- 3/17- Change net name to port name
- (UART1_RTS_3V)
- (UART1_CTS_3V)
- (GPIO_P13)
- (GPIO_P18)
- (near R154) BRD_ID_0
- (near R154) BRD_ID_1
- BRD_ID_2
- (GPIO_P22)
- BRD_ID_3
- BRD_ID_4
- (GPIO_P29)
- Borad_ID[4:0]:
- These SAI5_** pins are GPIO with default 90K PD resistor inside SOC.
- Coral BaseBoard: 00001 (default).
- (GPIO_P31)
- (GPIO_P36)
- (near SH4) Hat Board Mounting Holes
- (near SSH4) SOM Guiding Holes
- FROM BASEBOARD
- (near TP35) Internal soft Start  timer 0.4ms
- Project:
- Engineer:
- Date:
- File:
- Revision:
- Sheet
- of

### Library data of the parts
C84 C139 = CAP_0603_22uF: as C74 on sheet 06_GBE_SDCARD; Supplier 1: Digi-Key; Supplier Part Number 1: 1276-2867-2-ND; QCI Supplier: MUR
C85 = CAP_0603_22uF: CAP CER 22UF 6.3V 10% X5R 0603; MPN: CL10A226KQ8NRNE; QCI MPN: GRM188R61A226M; QPN: CH6222M9901; QPN Description: CAP CHIP 22UF 10V(+-20%,X5R,0603); Function Code: DOK; Supplier 1: Digi-Key; Supplier Part Number 1: 1276-2867-2-ND; QCI Supplier: MUR
C97-C100 = CAP_0402_10uF: CAP CER 10UF 10V 20% X5R 0402; MPN: CL05A106MP5NUNC; QCI MPN: GRM155R61A106M; QPN: CH6102M9B00; QPN Description: CAP CHIP 10U 10V (+-20%, X5R, 0402)'; Function Code: DCD; Supplier 1: Digi-Key; Supplier Part Number 1: 1276-1450-1-ND; QCI Supplier: MUR
J15 = CONN_HEADER_20x2_SMT: SOCKET 2X20 100-MIL STRAIGHT SMT; Function Code: DOK; QPN: DFHD20MS161; QPN Description: CONN DIP HEADER 20P 2R MS(P2.54,H8.3); Supplier 1: Samtec; Supplier Part Number 1: 210-P92-20GBEG; MPN: 210-P92-20GBEG; QCI MPN: 210-P92-20GBEG; QCI Supplier: PRX
L2 L3 = INDUCTOR_VLS201612ET-2R2M: FIXED IND 2.2UH 1.05A 195 MOHM SMD; QPN: CV-2210MZ02; QPN Description: IND SMD2.2UH+-20%1.05A(VLS201612ET-2R2M); Function Code: DCD; Supplier 1: Digi-Key; Value: 2.2uH; MPN: VLS201612ET-2R2M; QCI MPN: VLS201612ET-2R2M; QCI Supplier: TDK
L8 = INDUCTOR_2.2uH_800mA_0805: 2.2?Inductor 800mA 200 mOhm Max 0805 (2012 Metric); MPN: SDTR20120H-2R2MS; QPN: CV-2213MZ14; Function Code: DOK; QPN Description: IND SMD 2.2UH +-20%1.3A SDTR20120H-2R2MS; Value: 2.2uH; QCI Supplier: CYN; QCI MPN: SDTR20120H-2R2MS
R13 R17 = R_0201_10K: RES SMD 10K OHM JUMPER 1/20W  0201; MPN: ERJ-1GEF103C; QCI MPN: RC0201JR-1310KL; DNP: V; QPN: CS31001JE16; QPN Description: RES CHIP 10K 1/20W +-5%(0201); Function Code: DCD; Supplier 1: Digi-Key; Supplier Part Number 1: P10.0KABCT-ND; QCI Supplier: YGO
  R17: VALUE: 10K_DNP
R121 = R_0201_453K: RES CHIP 45.3K 1/20W +-1%(0201); MPN: RM02FTN4532; QPN: CS34531FE01; Function Code: DCD; Supplier 1: Digi-Key; VALUE: 45.3K; Supplier Part Number 1: P453KABCT-ND; QCI MPN: RM02FTN4532; QCI Supplier: YGO; QPN Description: RES CHIP 45.3K 1/20W +-1%(0201)
R122 R126 = R_0201_0: RES SMD 0.0OHM JUMPER 1/20W 0201; MPN: ERJ-1GN0R00C; QCI MPN: RC0201JR-130RL; QPN: CS00001JE18; QPN Description: RES CHIP 0(1/20W,+-5%,0201); Function Code: DCD; Supplier 1: Digi-Key; Supplier Part Number 1: P15979CT-ND; QCI Supplier: YGO
  R126: VALUE: 0R
R123 = R_0201_10K: RES SMD 10K OHM JUMPER 1/20W  0201; MPN: ERJ-1GEF103C; QCI MPN: RC0201JR-1310KL; QPN: CS31001FE14; QPN Description: RES CHIP 10K 1/20W +-1%(0201); Function Code: DCD; Supplier 1: Digi-Key; Supplier Part Number 1: P10.0KABCT-ND; QCI Supplier: YGO
R124 = R_0201_10K: RES SMD 10K OHM JUMPER 1/20W  0201; MPN: ERJ-1GEF103C; QCI MPN: RC0201JR-1310KL; QPN: CS31001JE16; QPN Description: RES CHIP 10K 1/20W +-5%(0201); Function Code: DCD; Supplier 1: Digi-Key; Supplier Part Number 1: P10.0KABCT-ND; VALUE: 10K; QCI Supplier: YGO
R125 R127 = R_0201_100K: RES SMD 100K OHM JUMPER 1/20W  0201; MPN: ERJ-1GEF1003C; QCI MPN: RC0201FR-07100KL; QPN: TS41001FE04; QPN Description: RES CHIP 100K 1/20W +-1%(0201)EMS-SEL; Function Code: DCD; Supplier 1: Digi-Key; VALUE: 100K; Supplier Part Number 1: P100KABCT-ND; QCI Supplier: YGO
R128 = R_0201_20K: RES SMD 20K OHM 1% 1/20W 0201; MPN: ERJ-1GEF2002C; QCI MPN: RC0201FR-0720KL; QPN: CS32001FE00; QPN Description: RES CHIP 20K 1/20W +-1%(0201); Function Code: DCD; Supplier 1: Digi-Key; Supplier Part Number 1: P20.0KABCT-ND; VALUE: 20K; QCI Supplier: YGO
R154 = R_0201_1K: RES SMD 1K OHM 1% 1/20W 0201; MPN: ERJ-1GEF1001C; QCI MPN: RC0201FR-131KL; QPN: CS21001FE04; QPN Description: RES CHIP 1K 1/20W +-1%(0201); Function Code: DOK; Supplier 1: Digi-Key; Supplier Part Number 1: P1.00KABCT-ND; QCI Supplier: YGO
R155-R158 = R_0201_1K: RES SMD 1K OHM 1% 1/20W 0201; MPN: ERJ-1GEF1001C; QCI MPN: RC0201FR-131KL; DNP: V; QPN: CS21001FE04; QPN Description: RES CHIP 1K 1/20W +-1%(0201); Function Code: DOK; Supplier 1: Digi-Key; Supplier Part Number 1: P1.00KABCT-ND; VALUE: 1K_DNP; QCI Supplier: YGO
SH1-SH4 TP1 = TP: TEST POIN
SSH1-SSH4 = TP: QCI MPN: 1000401131
TP34 TP35 = TP_L: TEST POINT (Large)
U12 = AP3427M: Dual 1A, 1.5NMhz, Sync Step-Down DC/DC Converter; QPN: LL003427000; QPN Description: IC OTHER(10P)AP3427MDNTR(DFN3030)ESEL; Function Code: DCD; Supplier 1: Digi-Key; Supplier Part Number 1: AP3427MDNTR-G1DICT-ND; MPN: AP3427MDNTR-G1DICT; QCI MPN: AP3427MDNTR-G1; QCI Supplier: DDS